# EAGLE schematic Sample End Effector (EAGLE 7.0.0)
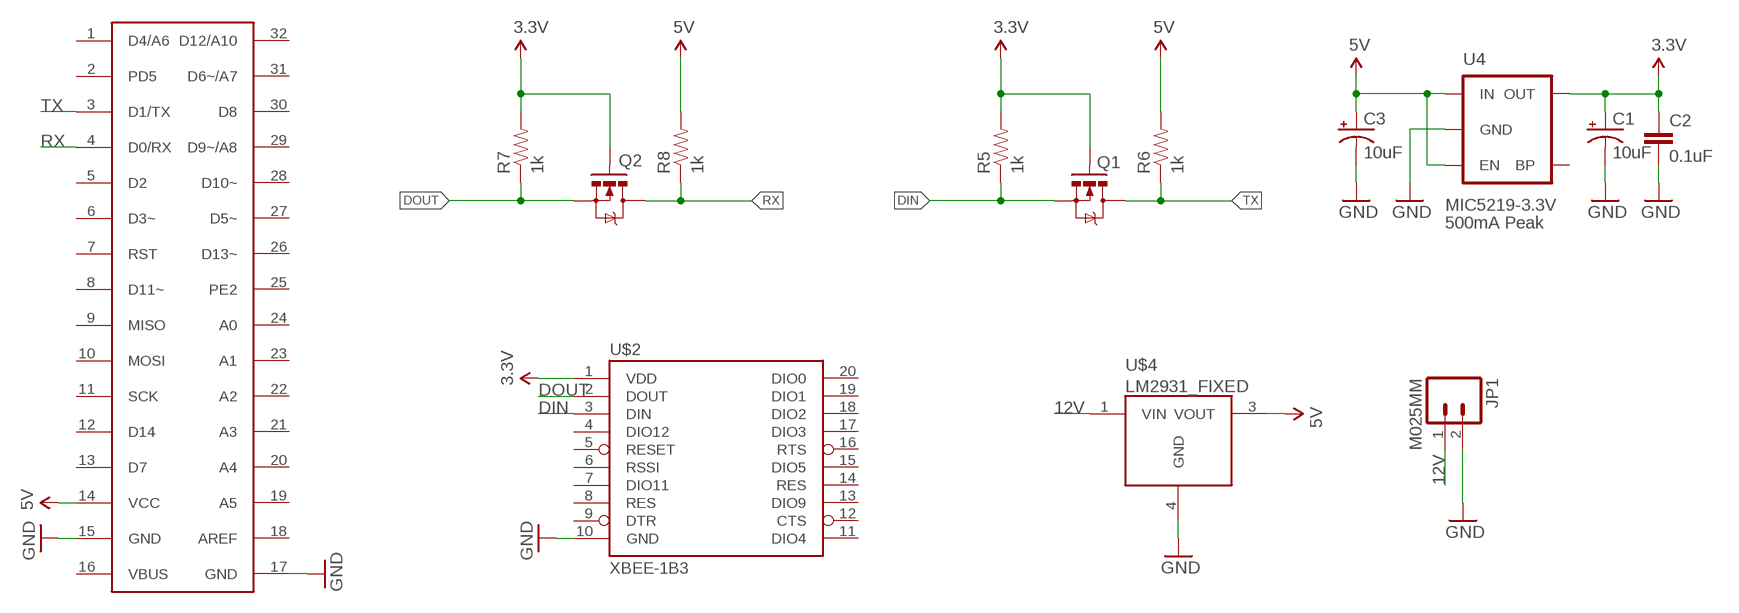
[diagram p0: schematic, sheet 1]

## Parts
C1  10uF  CAP_POL1206  [EIA3216]
C2  0.1uF  0.1UF-25V(+80/-20%)(0603)  [0603-CAP]
C3  10uF  CAP_POL1206  [EIA3216]
JP1  M025MM  [SCREWTERMINAL-5MM-2]
Q1  MOSFET-NCHANNELSMD  [SOT23-3]
Q2  MOSFET-NCHANNELSMD  [SOT23-3]
R5  1k  1KOHM1/10W1%(0603)  [0603-RES]
R6  1k  1KOHM1/10W1%(0603)  [0603-RES]
R7  1k  1KOHM1/10W1%(0603)  [0603-RES]
R8  1k  1KOHM1/10W1%(0603)  [0603-RES]
U4  V_REG_LDOSMD  [SOT23-5]
U$1  32U4  [DIP]
U$2  XBEE-1B3  [XBEE-SMD]
U$4  LM2931_FIXED  [DPAK]

## Nets
3.3V: C1.A(+) C2.1 Q1.1(G) Q2.1(G) R5.2 R7.2 U4.5(OUT) U$2.1(VDD)
5V: C3.A(+) R6.2 R8.2 U4.1(IN) U4.3(EN) U$1.14(VCC) U$4.3(VOUT)
12V: JP1.1 U$4.1(VIN)
DIN: Q1.2(S) R5.1 U$2.3(DIN)
DOUT: Q2.2(S) R7.1 U$2.2(DOUT)
GND: C1.C(-) C2.2 C3.C(-) JP1.2 U4.2(GND) U$1.15(GND) U$1.17(GND) U$2.10(GND) U$4.4(GND)
RX: Q2.3(D) R8.1 U$1.4(D0/RX)
TX: Q1.3(D) R6.1 U$1.3(D1/TX)
Unconnected: U4.4(BP) U$1.1(D4/A6) U$1.2(PD5) U$1.5(D2) U$1.6(D3~) U$1.7(RST) U$1.8(D11~) U$1.9(MISO) U$1.10(MOSI) U$1.11(SCK) U$1.12(D14) U$1.13(D7) U$1.16(VBUS) U$1.18(AREF) U$1.19(A5) U$1.20(A4) U$1.21(A3) U$1.22(A2) U$1.23(A1) U$1.24(A0) U$1.25(PE2) U$1.26(D13~) U$1.27(D5~) U$1.28(D10~) U$1.29(D9~/A8) U$1.30(D8) U$1.31(D6~/A7) U$1.32(D12/A10) U$2.4(DIO12) U$2.5(RESET) U$2.6(RSSI) U$2.7(DIO11) U$2.8(RES) U$2.9(DTR) U$2.11(DIO4) U$2.12(CTS) U$2.13(DIO9) U$2.14(RES) U$2.15(DIO5) U$2.16(RTS) U$2.17(DIO3) U$2.18(DIO2) U$2.19(DIO1) U$2.20(DIO0)

## Notes on the sheet
- MIC5219-3.3V
- 500mA Peak

## Library data of the parts
C1 C3 = SparkFun:CAP_POL: Capacitor Polarized These are standard SMD and PTH capacitors. Normally 10uF, 47uF, and 100uF in electrolytic and tantalum varieties. Always verify the external diameter of the through hole cap, it varies with capacity, voltage, and manufacturer. The EIA devices should be standard.
C2 = SparkFun-Capacitors:0.1UF-25V(+80/-20%)(0603): CAP-00810 Ceramic Standard decoupling cap; PROD_ID: CAP-00810
JP1 = SparkFun-Connectors:M02: Standard 2-pin 0.1" header. Use with - straight break away headers ( PRT-00116) - right angle break away headers (PRT-00553) - swiss pins (PRT-00743) - machine pins (PRT-00117) - female headers (PRT-00115) Molex polarized connector foot print use with: PRT-08233 with associated crimp pins and housings. 2.54_SCREWTERM for use with PRT-10571. 3.5mm Screw Terminal footprints for PRT-08084 5mm Screw Terminal footprints for use with PRT-08433
Q1 Q2 = SparkFun-DiscreteSemi:MOSFET-NCHANNEL: Generic NMOS footprint
R5-R8 = SparkFun-Resistors:1KOHM1/10W1%(0603): RES-07856; PROD_ID: RES-07856; VALUE: 1K
U4 = SparkFun-PowerIC:V_REG_LDO: Voltage Regulator LDO Standard 150mA LDO voltage regulator in SOT-23 layout. Micrel part MIC5205. BP (by-pass) pin is used to lower output noise with 470pF cap.
U$1 = 32U4:32U4
U$2 = SparkFun-RF:XBEE-1: Xbee module footprints SMT header is CONN-09042.; PROD_ID: CONN-09042
U$4 = SparkFun-PowerIC:LM2931_FIXED: LDO regulator with reverse battery protection- very durable!

## Net classes
0 default: width 0.203 mm